# Altium project rasp_sheild.PrjPcb
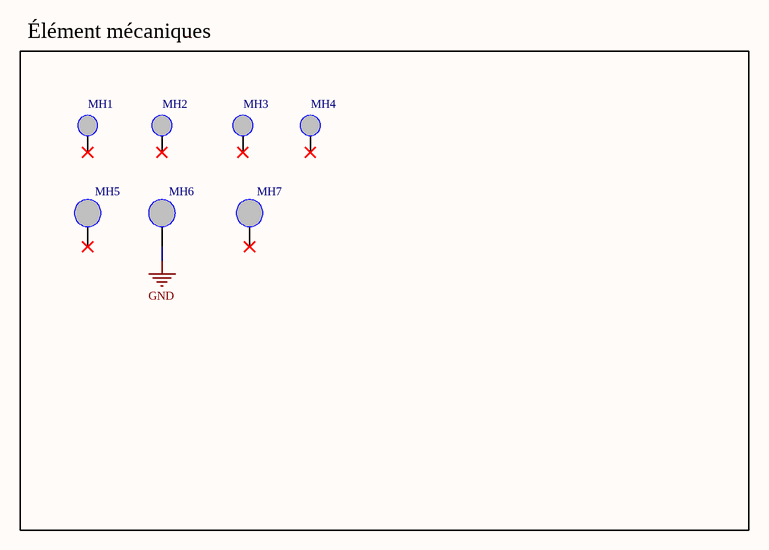
[diagram p0: rasp_sheild_title.SchDoc]
Project_Date: 2023-02-10; Project_Designer1: Julien Roy-Sabourin; Project_Global: Frigorus System; Project_Group: Frigorus; Project_Name: RaspberryPi Frigorus Sheild; Project_Revision: 1.0
5 sheets, 128 parts. Net scope: flat (ports and power ports of the same name join across sheets).
Board file: rasp_sheild.PcbDoc
Sheets:
  rasp_sheild_title.SchDoc
  rasp_sheild_main.SchDoc
  rasp_sheild_ADC.SchDoc
  rasp_sheild_i2c.SchDoc
  rasp_sheild_CAN.SchDoc

## Sheet rasp_sheild_title.SchDoc
size Tabloid; SheetNumber: 1; SheetTotal: 5; Sheet_Name: Insert name in Document Parameters; Size: 11x17

### Parts
MH1  Part Number  [MH2.75mm]  (value not drawn)
MH2  Part Number  [MH2.75mm]  (value not drawn)
MH3  Part Number  [MH2.75mm]  (value not drawn)
MH4  Part Number  [MH2.75mm]  (value not drawn)
MH5  Part Number  [MH3.2mm]  (value not drawn)
MH6  Part Number  [MH3.2mm]  (value not drawn)
MH7  Part Number  [MH3.2mm]  (value not drawn)

### Blocks framed on the sheet
Élément mécaniques: MH1-MH7

### Nets
GND: MH6.1

Not connected (* = marked no-connect by the designer): MH1 1*; MH2 1*; MH3 1*; MH4 1*; MH5 1*; MH7 1*

### Notes on the sheet
- Revision history
- Package size conversion
- Metric
- 1005
- 1608
- Imperial
- 0402
- 0603
- Revision
- 2012
- 3216
- 0805
- 1206
- 3225
- 6432
- 1210
- 2512
- Date :
- Project Title
- Global Project
- Size
- Group
- Date
- Sheet
- of
- Filename
- Designers

### Library data of the parts
MH1-MH4 = MH2.75mm: XXX - Description - Package; GRAMS Lib Spec: 2.7
MH5-MH7 = MH3.2mm: M3 mounting hole; GRAMS Lib Spec: 2.7

## Sheet rasp_sheild_main.SchDoc
size Tabloid; SheetNumber: 2; SheetTotal: 5; Sheet_Name: RaspberryPi Frigorus Sheild; Size: 11x17
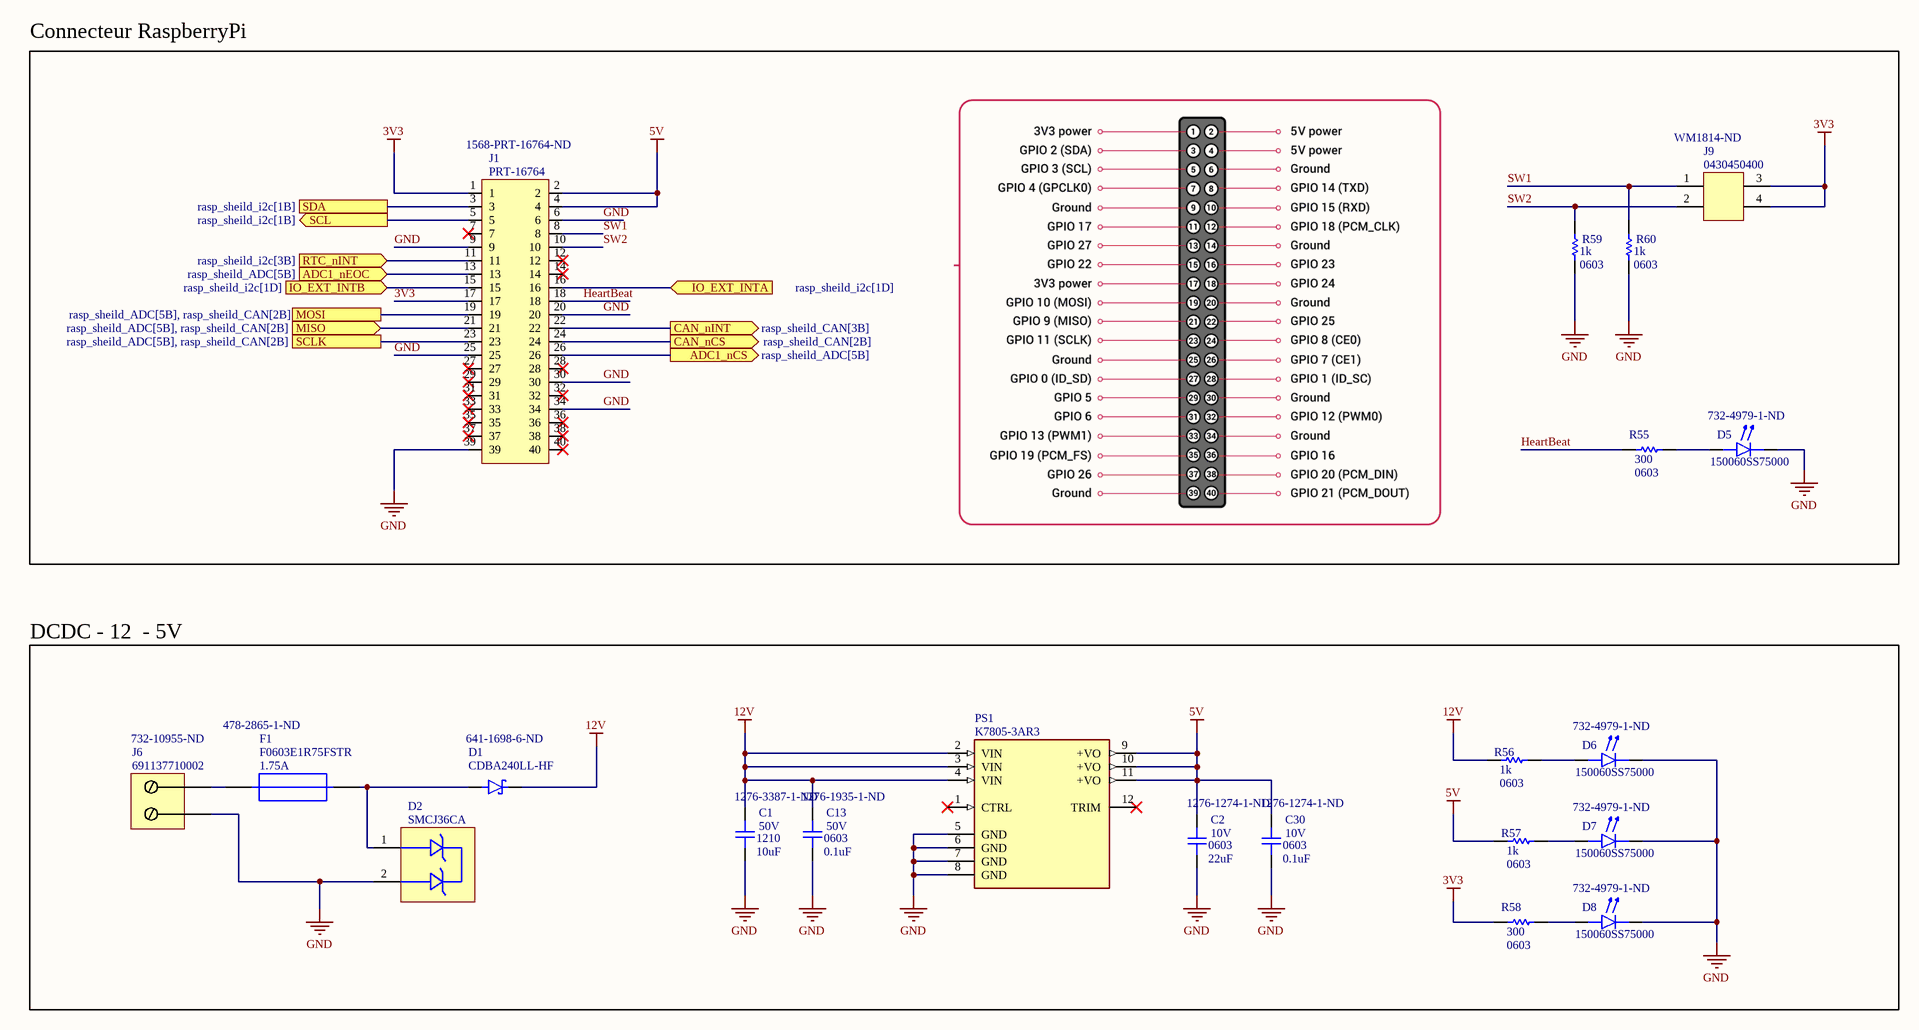
[diagram p1: rasp_sheild_main.SchDoc]

### Parts
C1  value 10uF  Voltage Rating: 50V  Package: 1210  Supplier Part Number 1: 1276-3387-1-ND  [CAP_1210]  (hidden comment: CL32B106KBJNNNE)
C2  value 22uF  Voltage Rating: 10V  Package: 0603  Supplier Part Number 1: 1276-1274-1-ND  [CAP_0603]  (hidden comment: CL10A226MP8NUNE)
C13  value 0.1uF  Voltage Rating: 50V  Package: 0603  Supplier Part Number 1: 1276-1935-1-ND  [CAP_0603]  (hidden comment: CL10B104KB8NNWC)
C30  value 0.1uF  Voltage Rating: 10V  Package: 0603  Supplier Part Number 1: 1276-1274-1-ND  [CAP_0603]  (hidden comment: CL10A226MP8NUNE)
D1  CDBA240LL-HF  Supplier Part Number 1: 641-1698-6-ND  [DO-214]
D2  SMCJ36CA  [SMCJ36CA]
D5  150060SS75000  Supplier Part Number 1: 732-4979-1-ND  [LED 0603]
D6  150060SS75000  Supplier Part Number 1: 732-4979-1-ND  [LED 0603]
D7  150060SS75000  Supplier Part Number 1: 732-4979-1-ND  [LED 0603]
D8  150060SS75000  Supplier Part Number 1: 732-4979-1-ND  [LED 0603]
F1  F0603E1R75FSTR  value 1.75A  Supplier Part Number 1: 478-2865-1-ND  [RES_0603]
J1  PRT-16764  Supplier Part Number 1: 1568-PRT-16764-ND  [PRT-16764]
J6  691137710002  Supplier Part Number 1: 732-10955-ND  [691137710002]
J9  0430450400  Supplier Part Number 1: WM1814-ND  [0430450400]
PS1  K7805-3AR3  [CONV_K7805-3AR3]
R55  value 300  Package: 0603  [RES_0603]  (hidden comment: RC0603JR-07300RL)
R56  value 1k  Package: 0603  [RES_0603]  (hidden comment: Part Number)
R57  value 1k  Package: 0603  [RES_0603]  (hidden comment: Part Number)
R58  value 300  Package: 0603  [RES_0603]  (hidden comment: RC0603JR-07300RL)
R59  value 1k  Package: 0603  [RES_0603]  (hidden comment: Part Number)
R60  value 1k  Package: 0603  [RES_0603]  (hidden comment: Part Number)

### Blocks framed on the sheet
Connecteur RaspberryPi: D5 J1 J9 R55 R59 R60
DCDC - 12  - 5V: C1 C2 C13 C30 D1 D2 D6-D8 F1 J6 PS1 R56-R58

### Ports
ADC1_nCS (out, see rasp_sheild_ADC[5B]), ADC1_nEOC (in, see rasp_sheild_ADC[5B]), CAN_nCS (out, see rasp_sheild_CAN[2B]), CAN_nINT (out, see rasp_sheild_CAN[3B]), IO_EXT_INTA (in, see rasp_sheild_i2c[1D]), IO_EXT_INTB (in, see rasp_sheild_i2c[1D]), MISO (in, see rasp_sheild_ADC[5B], rasp_sheild_CAN[2B]), MOSI (see rasp_sheild_ADC[5B], rasp_sheild_CAN[2B]), RTC_nINT (in, see rasp_sheild_i2c[3B]), SCL (out, see rasp_sheild_i2c[1B]), SCLK (see rasp_sheild_ADC[5B], rasp_sheild_CAN[2B]), SDA (see rasp_sheild_i2c[1B])

### Nets
3V3: J1.1 J1.17 J9.3 J9.4 R58.2
5V: C2.2 C30.2 J1.2 J1.4 PS1.9(+VO) PS1.10(+VO) PS1.11(+VO) R57.2
12V: C1.2 C13.2 D1.C(K) PS1.2(VIN) PS1.3(VIN) PS1.4(VIN) R56.2
GND: C1.1 C2.1 C13.1 C30.1 D2.2 D5.K D6.K D7.K D8.K J1.6 J1.9 J1.20 J1.25 J1.30 J1.34 J1.39 J6.2 PS1.5(GND) PS1.6(GND) PS1.7(GND) PS1.8(GND) R59.1 R60.1
ADC1_nCS: J1.26 ; port ADC1_nCS
ADC1_nEOC: J1.13 ; port ADC1_nEOC
CAN_nCS: J1.24 ; port CAN_nCS
CAN_nINT: J1.22 ; port CAN_nINT
HeartBeat: J1.18 R55.2
IO_EXT_INTA: J1.16 ; port IO_EXT_INTA
IO_EXT_INTB: J1.15 ; port IO_EXT_INTB
MISO: J1.21 ; port MISO
MOSI: J1.19 ; port MOSI
RTC_nINT: J1.11 ; port RTC_nINT
SCL: J1.5 ; port SCL
SCLK: J1.23 ; port SCLK
SDA: J1.3 ; port SDA
SW1: J1.8 J9.1 R60.2
SW2: J1.10 J9.2 R59.2
NetD1_A: D1.A D2.1 F1.2
NetD5_A: D5.A R55.1
NetD6_A: D6.A R56.1
NetD7_A: D7.A R57.1
NetD8_A: D8.A R58.1
NetF1_1: F1.1 J6.1

Not connected (* = marked no-connect by the designer): J1 7* 12* 14* 27* 28* 29* 31* 32* 33* 35* 36* 37* 38* 40*; PS1 1(CTRL)* 12(TRIM)*

### Notes on the sheet
- Sheet Name
- Project Title
- Global Project
- Revision
- Size
- Date
- Group
- Sheet
- of
- Filename
- Designers

### Library data of the parts
C1 = CAP_1210: XXX - Description - Package; GRAMS Lib Spec: 2.7; Supplier 1: Digi-Key
C2 C13 C30 = CAP_0603: XXX - Description - Package; GRAMS Lib Spec: 2.7; Supplier 1: Digi-Key
D1 = CDBA240LL-HF: Diode 40 V 2A Surface Mount DO-214AC (SMA); GRAMS Lib Spec: 2.7; Supplier 1: Digi-Key
D2 = SMCJ36CA: 44.2V Clamp 25.8A Ipp Tvs Diode Surface Mount DO-214AB (SMC); GRAMS Lib Spec: 2.7
D5-D8 = 150060SS75000: Red 630nm LED Indication - Discrete 1.9V 0603 (1608 Metric); GRAMS Lib Spec: 2.7; Supplier 1: Digi-Key
F1 = F0603E1R75FSTR: 1.75 A AC 32 V DC Fuse Board Mount (Cartridge Style Excluded) Surface Mount 0603 (1608 Metric); GRAMS Lib Spec: 2.7; Supplier 1: Digi-Key
J1 = PRT-14275_1: EXTENDED GPIO FEMALE HEADER - 2X; GRAMS Lib Spec: 2.7; Supplier 1: Digi-Key
J6 = 691137710002: 2 Position Wire to Board Terminal Block Horizontal with Board 0.197" (5.00mm) Through Hole; GRAMS Lib Spec: 2.7; Supplier 1: Digi-Key
J9 = 0430450400: Connector Header Through Hole, Right Angle 4 position 0.118" (3.00mm); GRAMS Lib Spec: 2.7; Supplier 1: Digi-Key
PS1 = K7805-3AR3: Non-Isolated PoL Module DC DC Converter 1 Output 5V - - - 3A 8V - 36V Input; MF: Mornsun America, LLC; Value: *; SnapEDA_Link: https://www.snapeda.com/parts/K7805-3AR3/MORNSUN/view-part/?ref=snap; Purchase-URL: https://pricing.snapeda.com/search/part/K7805-3AR3/?ref=eda; Availability: In Stock; Price: None; Package: SIP-12-12 MORNSUN; Check_prices: https://www.snapeda.com/parts/K7805-3AR3/MORNSUN/view-part/?ref=eda; MP: K7805-3AR3; Supplier 1: Digi-Key; Supplier Part Number 1: 2725-K7805-3AR3-ND
R55-R60 = RES_0603: XXX - Description - Package; GRAMS Lib Spec: 2.7; Supplier 1: Digi-Key
  R55 R58: Supplier Part Number 1: 311-300GRCT-ND
  R56 R57 R59 R60: Supplier Part Number 1: 311-1.00KHRCT-ND

## Sheet rasp_sheild_ADC.SchDoc
size Tabloid; SheetNumber: 3; SheetTotal: 5; Sheet_Name: Lecture analogique thermistances; Size: 11x17
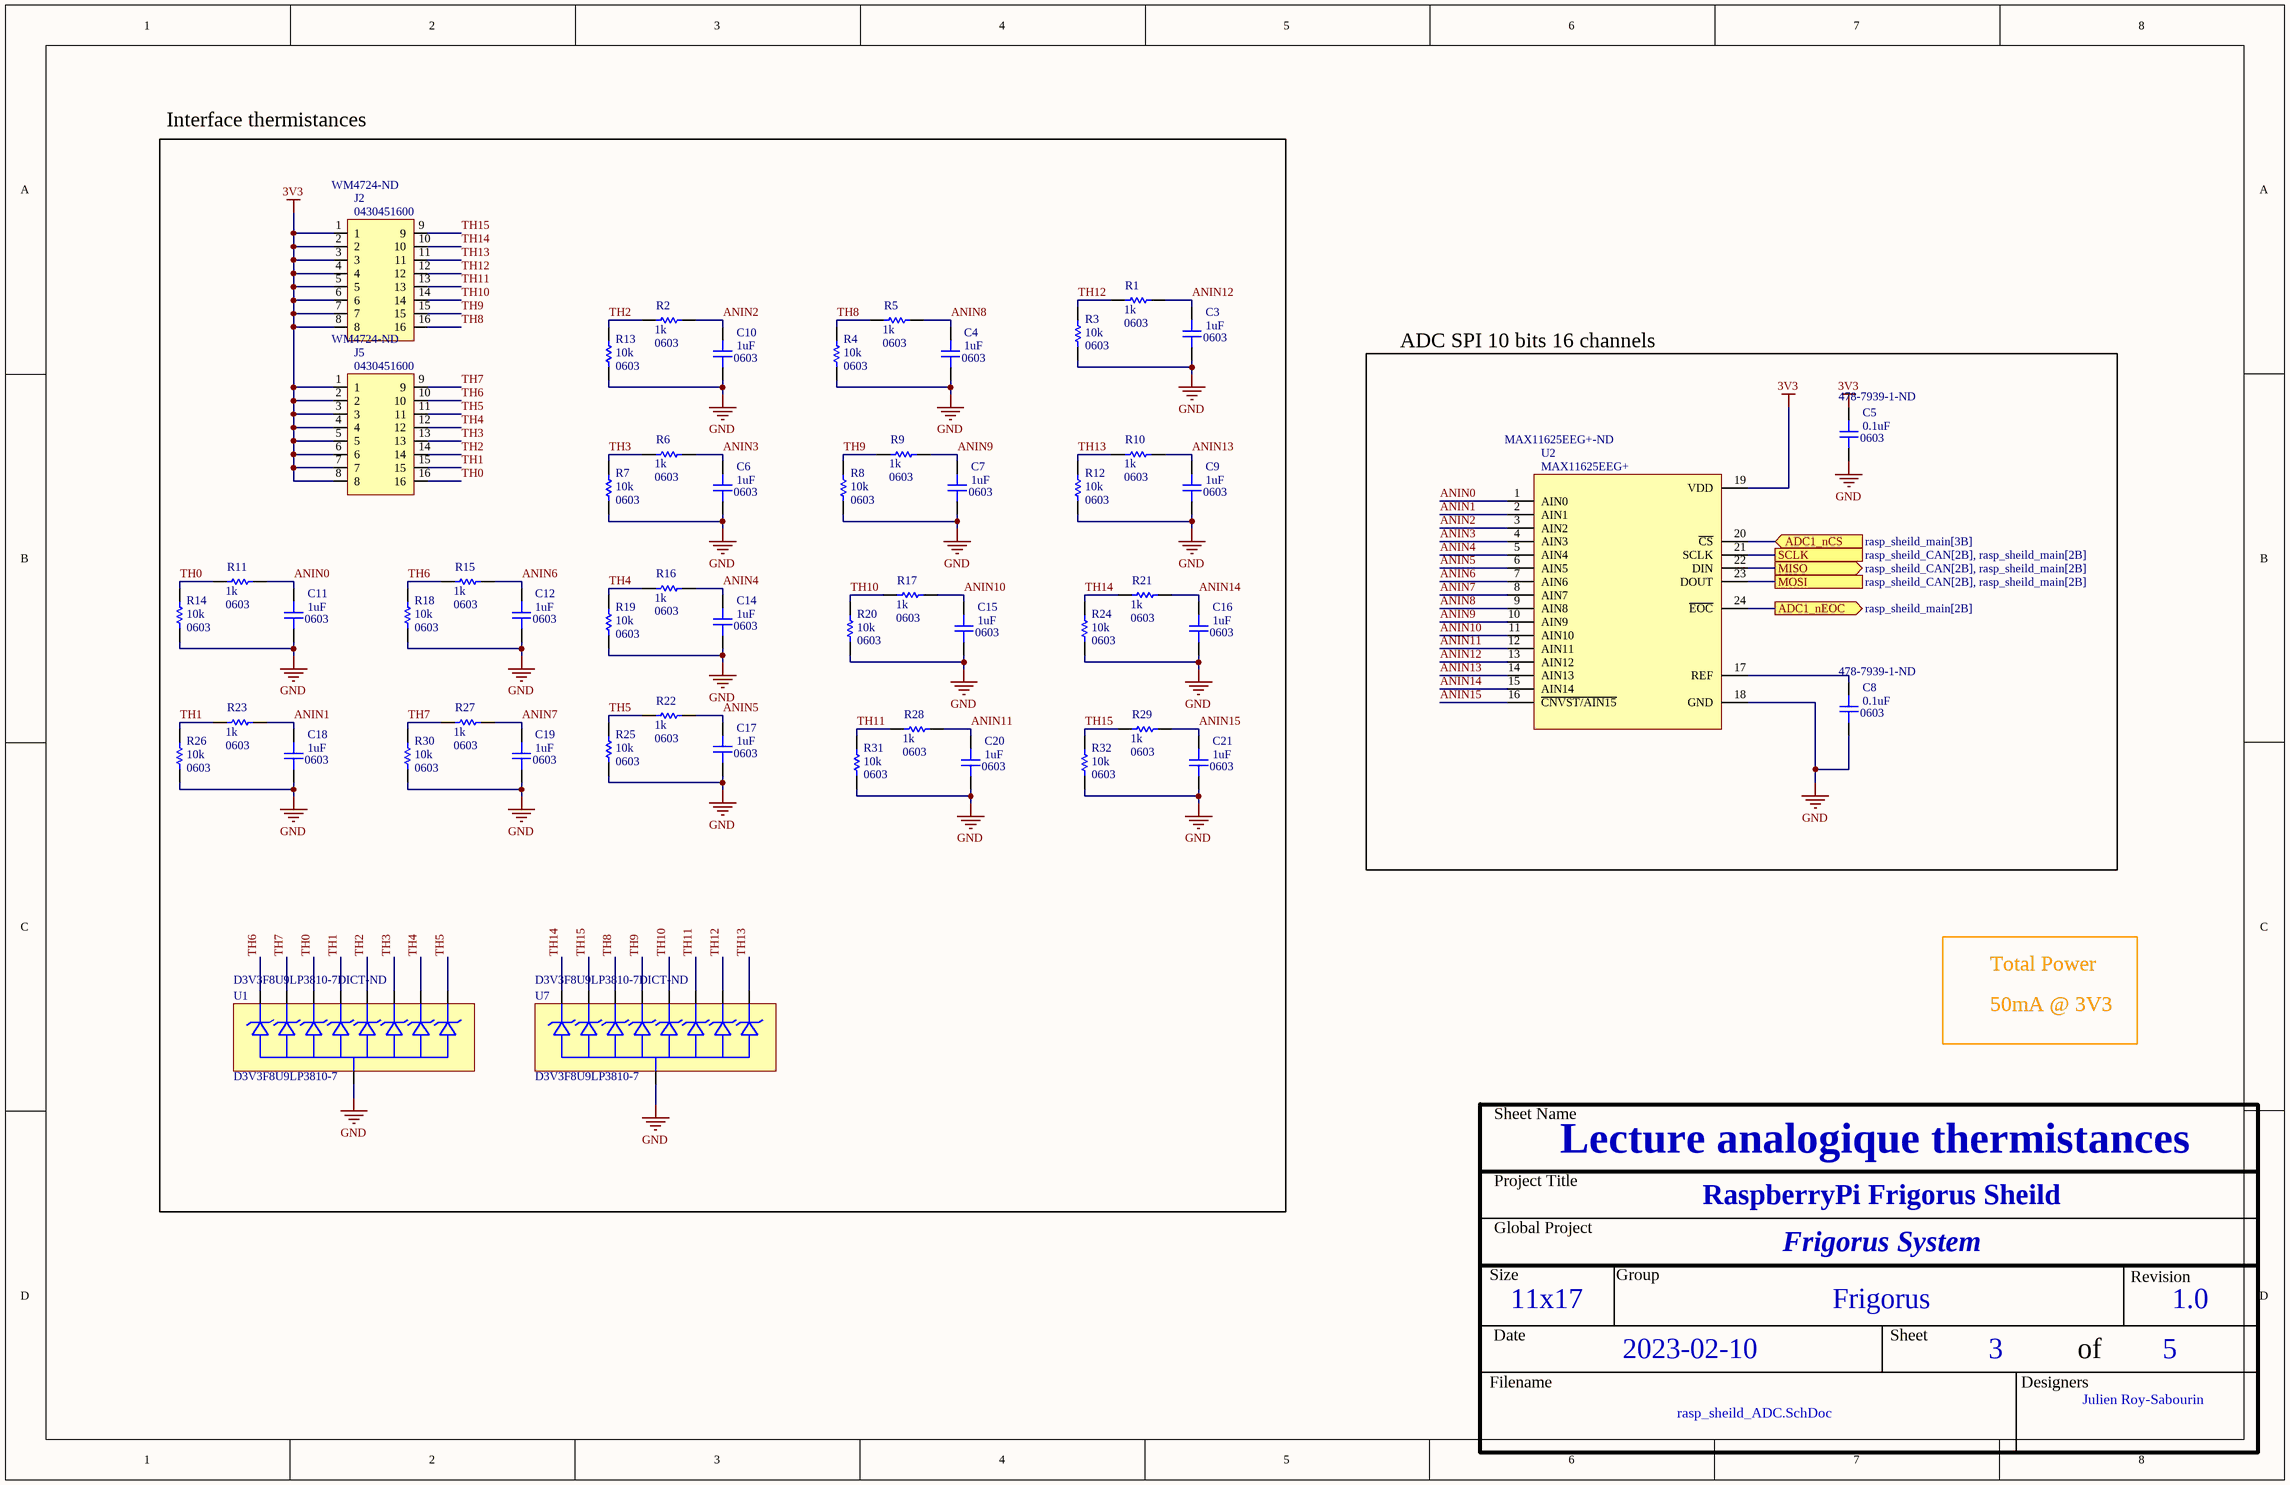
[diagram p2: rasp_sheild_ADC.SchDoc]

### Parts
C3  value 1uF  Package: 0603  [CAP_0603]  (hidden comment: Part Number)
C4  value 1uF  Package: 0603  [CAP_0603]  (hidden comment: Part Number)
C5  value 0.1uF  Package: 0603  Supplier Part Number 1: 478-7939-1-ND  [CAP_0603]  (hidden comment: Part Number)
C6  value 1uF  Package: 0603  [CAP_0603]  (hidden comment: Part Number)
C7  value 1uF  Package: 0603  [CAP_0603]  (hidden comment: Part Number)
C8  value 0.1uF  Package: 0603  Supplier Part Number 1: 478-7939-1-ND  [CAP_0603]  (hidden comment: Part Number)
C9  value 1uF  Package: 0603  [CAP_0603]  (hidden comment: Part Number)
C10  value 1uF  Package: 0603  [CAP_0603]  (hidden comment: Part Number)
C11  value 1uF  Package: 0603  [CAP_0603]  (hidden comment: Part Number)
C12  value 1uF  Package: 0603  [CAP_0603]  (hidden comment: Part Number)
C14  value 1uF  Package: 0603  [CAP_0603]  (hidden comment: Part Number)
C15  value 1uF  Package: 0603  [CAP_0603]  (hidden comment: Part Number)
C16  value 1uF  Package: 0603  [CAP_0603]  (hidden comment: Part Number)
C17  value 1uF  Package: 0603  [CAP_0603]  (hidden comment: Part Number)
C18  value 1uF  Package: 0603  [CAP_0603]  (hidden comment: Part Number)
C19  value 1uF  Package: 0603  [CAP_0603]  (hidden comment: Part Number)
C20  value 1uF  Package: 0603  [CAP_0603]  (hidden comment: Part Number)
C21  value 1uF  Package: 0603  [CAP_0603]  (hidden comment: Part Number)
J2  0430451600  Supplier Part Number 1: WM4724-ND  [0430451600]
J5  0430451600  Supplier Part Number 1: WM4724-ND  [0430451600]
R1  value 1k  Package: 0603  [RES_0603]  (hidden comment: Part Number)
R2  value 1k  Package: 0603  [RES_0603]  (hidden comment: Part Number)
R3  value 10k  Package: 0603  [RES_0603]  (hidden comment: Part Number)
R4  value 10k  Package: 0603  [RES_0603]  (hidden comment: Part Number)
R5  value 1k  Package: 0603  [RES_0603]  (hidden comment: Part Number)
R6  value 1k  Package: 0603  [RES_0603]  (hidden comment: Part Number)
R7  value 10k  Package: 0603  [RES_0603]  (hidden comment: Part Number)
R8  value 10k  Package: 0603  [RES_0603]  (hidden comment: Part Number)
R9  value 1k  Package: 0603  [RES_0603]  (hidden comment: Part Number)
R10  value 1k  Package: 0603  [RES_0603]  (hidden comment: Part Number)
R11  value 1k  Package: 0603  [RES_0603]  (hidden comment: Part Number)
R12  value 10k  Package: 0603  [RES_0603]  (hidden comment: Part Number)
R13  value 10k  Package: 0603  [RES_0603]  (hidden comment: Part Number)
R14  value 10k  Package: 0603  [RES_0603]  (hidden comment: Part Number)
R15  value 1k  Package: 0603  [RES_0603]  (hidden comment: Part Number)
R16  value 1k  Package: 0603  [RES_0603]  (hidden comment: Part Number)
R17  value 1k  Package: 0603  [RES_0603]  (hidden comment: Part Number)
R18  value 10k  Package: 0603  [RES_0603]  (hidden comment: Part Number)
R19  value 10k  Package: 0603  [RES_0603]  (hidden comment: Part Number)
R20  value 10k  Package: 0603  [RES_0603]  (hidden comment: Part Number)
R21  value 1k  Package: 0603  [RES_0603]  (hidden comment: Part Number)
R22  value 1k  Package: 0603  [RES_0603]  (hidden comment: Part Number)
R23  value 1k  Package: 0603  [RES_0603]  (hidden comment: Part Number)
R24  value 10k  Package: 0603  [RES_0603]  (hidden comment: Part Number)
R25  value 10k  Package: 0603  [RES_0603]  (hidden comment: Part Number)
R26  value 10k  Package: 0603  [RES_0603]  (hidden comment: Part Number)
R27  value 1k  Package: 0603  [RES_0603]  (hidden comment: Part Number)
R28  value 1k  Package: 0603  [RES_0603]  (hidden comment: Part Number)
R29  value 1k  Package: 0603  [RES_0603]  (hidden comment: Part Number)
R30  value 10k  Package: 0603  [RES_0603]  (hidden comment: Part Number)
R31  value 10k  Package: 0603  [RES_0603]  (hidden comment: Part Number)
R32  value 10k  Package: 0603  [RES_0603]  (hidden comment: Part Number)
U1  D3V3F8U9LP3810-7  Supplier Part Number 1: D3V3F8U9LP3810-7DICT-ND  [D3V3F8U9LP3810-7]
U2  MAX11625EEG+  Supplier Part Number 1: MAX11625EEG+-ND  [24-QSSOP]
U7  D3V3F8U9LP3810-7  Supplier Part Number 1: D3V3F8U9LP3810-7DICT-ND  [D3V3F8U9LP3810-7]

### Blocks framed on the sheet
Interface thermistances: C3 C4 C6 C7 C9-C12 C14-C21 J2 J5 R1-R32 U1 U7
ADC SPI 10 bits 16 channels: C5 C8 U2

### Ports
ADC1_nCS (in, see rasp_sheild_main[3B]), ADC1_nEOC (out, see rasp_sheild_main[2B]), MISO (out, see rasp_sheild_CAN[2B], rasp_sheild_main[2B]), MOSI (see rasp_sheild_CAN[2B], rasp_sheild_main[2B]), SCLK (see rasp_sheild_CAN[2B], rasp_sheild_main[2B])

### Nets
3V3: C5.2 J2.1 J2.2 J2.3 J2.4 J2.5 J2.6 J2.7 J2.8 J5.1 J5.2 J5.3 J5.4 J5.5 J5.6 J5.7 J5.8 U2.19(VDD)
GND: C3.1 C4.1 C5.1 C6.1 C7.1 C8.1 C9.1 C10.1 C11.1 C12.1 C14.1 C15.1 C16.1 C17.1 C18.1 C19.1 C20.1 C21.1 R3.2 R4.2 R7.2 R8.2 R12.2 R13.2 R14.2 R18.2 R19.2 R20.2 R24.2 R25.2 R26.2 R30.2 R31.2 R32.2 U1.3 U2.18(GND) U7.3
ADC1_nCS: U2.20(~{CS}) ; port ADC1_nCS
ADC1_nEOC: U2.24(~{EOC}) ; port ADC1_nEOC
ANIN0: C11.2 R11.1 U2.1(AIN0)
ANIN1: C18.2 R23.1 U2.2(AIN1)
ANIN2: C10.2 R2.1 U2.3(AIN2)
ANIN3: C6.2 R6.1 U2.4(AIN3)
ANIN4: C14.2 R16.1 U2.5(AIN4)
ANIN5: C17.2 R22.1 U2.6(AIN5)
ANIN6: C12.2 R15.1 U2.7(AIN6)
ANIN7: C19.2 R27.1 U2.8(AIN7)
ANIN8: C4.2 R5.1 U2.9(AIN8)
ANIN9: C7.2 R9.1 U2.10(AIN9)
ANIN10: C15.2 R17.1 U2.11(AIN10)
ANIN11: C20.2 R28.1 U2.12(AIN11)
ANIN12: C3.2 R1.1 U2.13(AIN12)
ANIN13: C9.2 R10.1 U2.14(AIN13)
ANIN14: C16.2 R21.1 U2.15(AIN14)
ANIN15: C21.2 R29.1 U2.16(~{CNVST/AIN15})
MISO: U2.22(DIN) ; port MISO
MOSI: U2.23(DOUT) ; port MOSI
SCLK: U2.21(SCLK) ; port SCLK
TH0: J5.16 R11.2 R14.1 U1.4
TH1: J5.15 R23.2 R26.1 U1.5
TH2: J5.14 R2.2 R13.1 U1.6
TH3: J5.13 R6.2 R7.1 U1.7
TH4: J5.12 R16.2 R19.1 U1.8
TH5: J5.11 R22.2 R25.1 U1.9
TH6: J5.10 R15.2 R18.1 U1.1
TH7: J5.9 R27.2 R30.1 U1.2
TH8: J2.16 R4.1 R5.2 U7.4
TH9: J2.15 R8.1 R9.2 U7.5
TH10: J2.14 R17.2 R20.1 U7.6
TH11: J2.13 R28.2 R31.1 U7.7
TH12: J2.12 R1.2 R3.1 U7.8
TH13: J2.11 R10.2 R12.1 U7.9
TH14: J2.10 R21.2 R24.1 U7.1
TH15: J2.9 R29.2 R32.1 U7.2
NetC8_2: C8.2 U2.17(REF)

### Notes on the sheet
- Total Power
- 50mA @ 3V3
- Sheet Name
- Project Title
- Global Project
- Size
- Group
- Revision
- Date
- Sheet
- of
- Filename
- Designers

### Library data of the parts
C3-C12 C14-C21 = CAP_0603: as C2 on sheet rasp_sheild_main; Supplier 1: Digi-Key
  C3 C4 C6 C7 C9-C12 C14-C21: Supplier Part Number 1: 399-C0603C105K8RAC7867CT-ND
J2 J5 = 0430451600: Connector Header Through Hole, Right Angle 16 position 0.118" (3.00mm); GRAMS Lib Spec: 2.7; Supplier 1: Digi-Key
R1-R32 = RES_0603: as R55 on sheet rasp_sheild_main; Supplier 1: Digi-Key
  R1 R2 R5 R6 R9-R11 R15-R17 R21-R23 R27-R29: Supplier Part Number 1: 311-1.00KHRCT-ND
  R3 R4 R7 R8 R12-R14 R18-R20 R24-R26 R30-R32: Supplier Part Number 1: 311-10.0KHRCT-ND
U1 U7 = D3V3F8U9LP3810-7: 5V (Typ) Clamp 5A (8/20µs) Ipp Tvs Diode Surface Mount U-DFN3810-9 (Type B); GRAMS Lib Spec: 2.7; Supplier 1: Digi-Key
U2 = MAX11625EEG+: 10 Bit Analog to Digital Converter 16 Input 1 SAR 24-QSOP; GRAMS Lib Spec: 2.7; Supplier 1: Digi-Key

## Sheet rasp_sheild_i2c.SchDoc
size Tabloid; SheetNumber: 4; SheetTotal: 5; Sheet_Name: Périphériques i2c; Size: 11x17
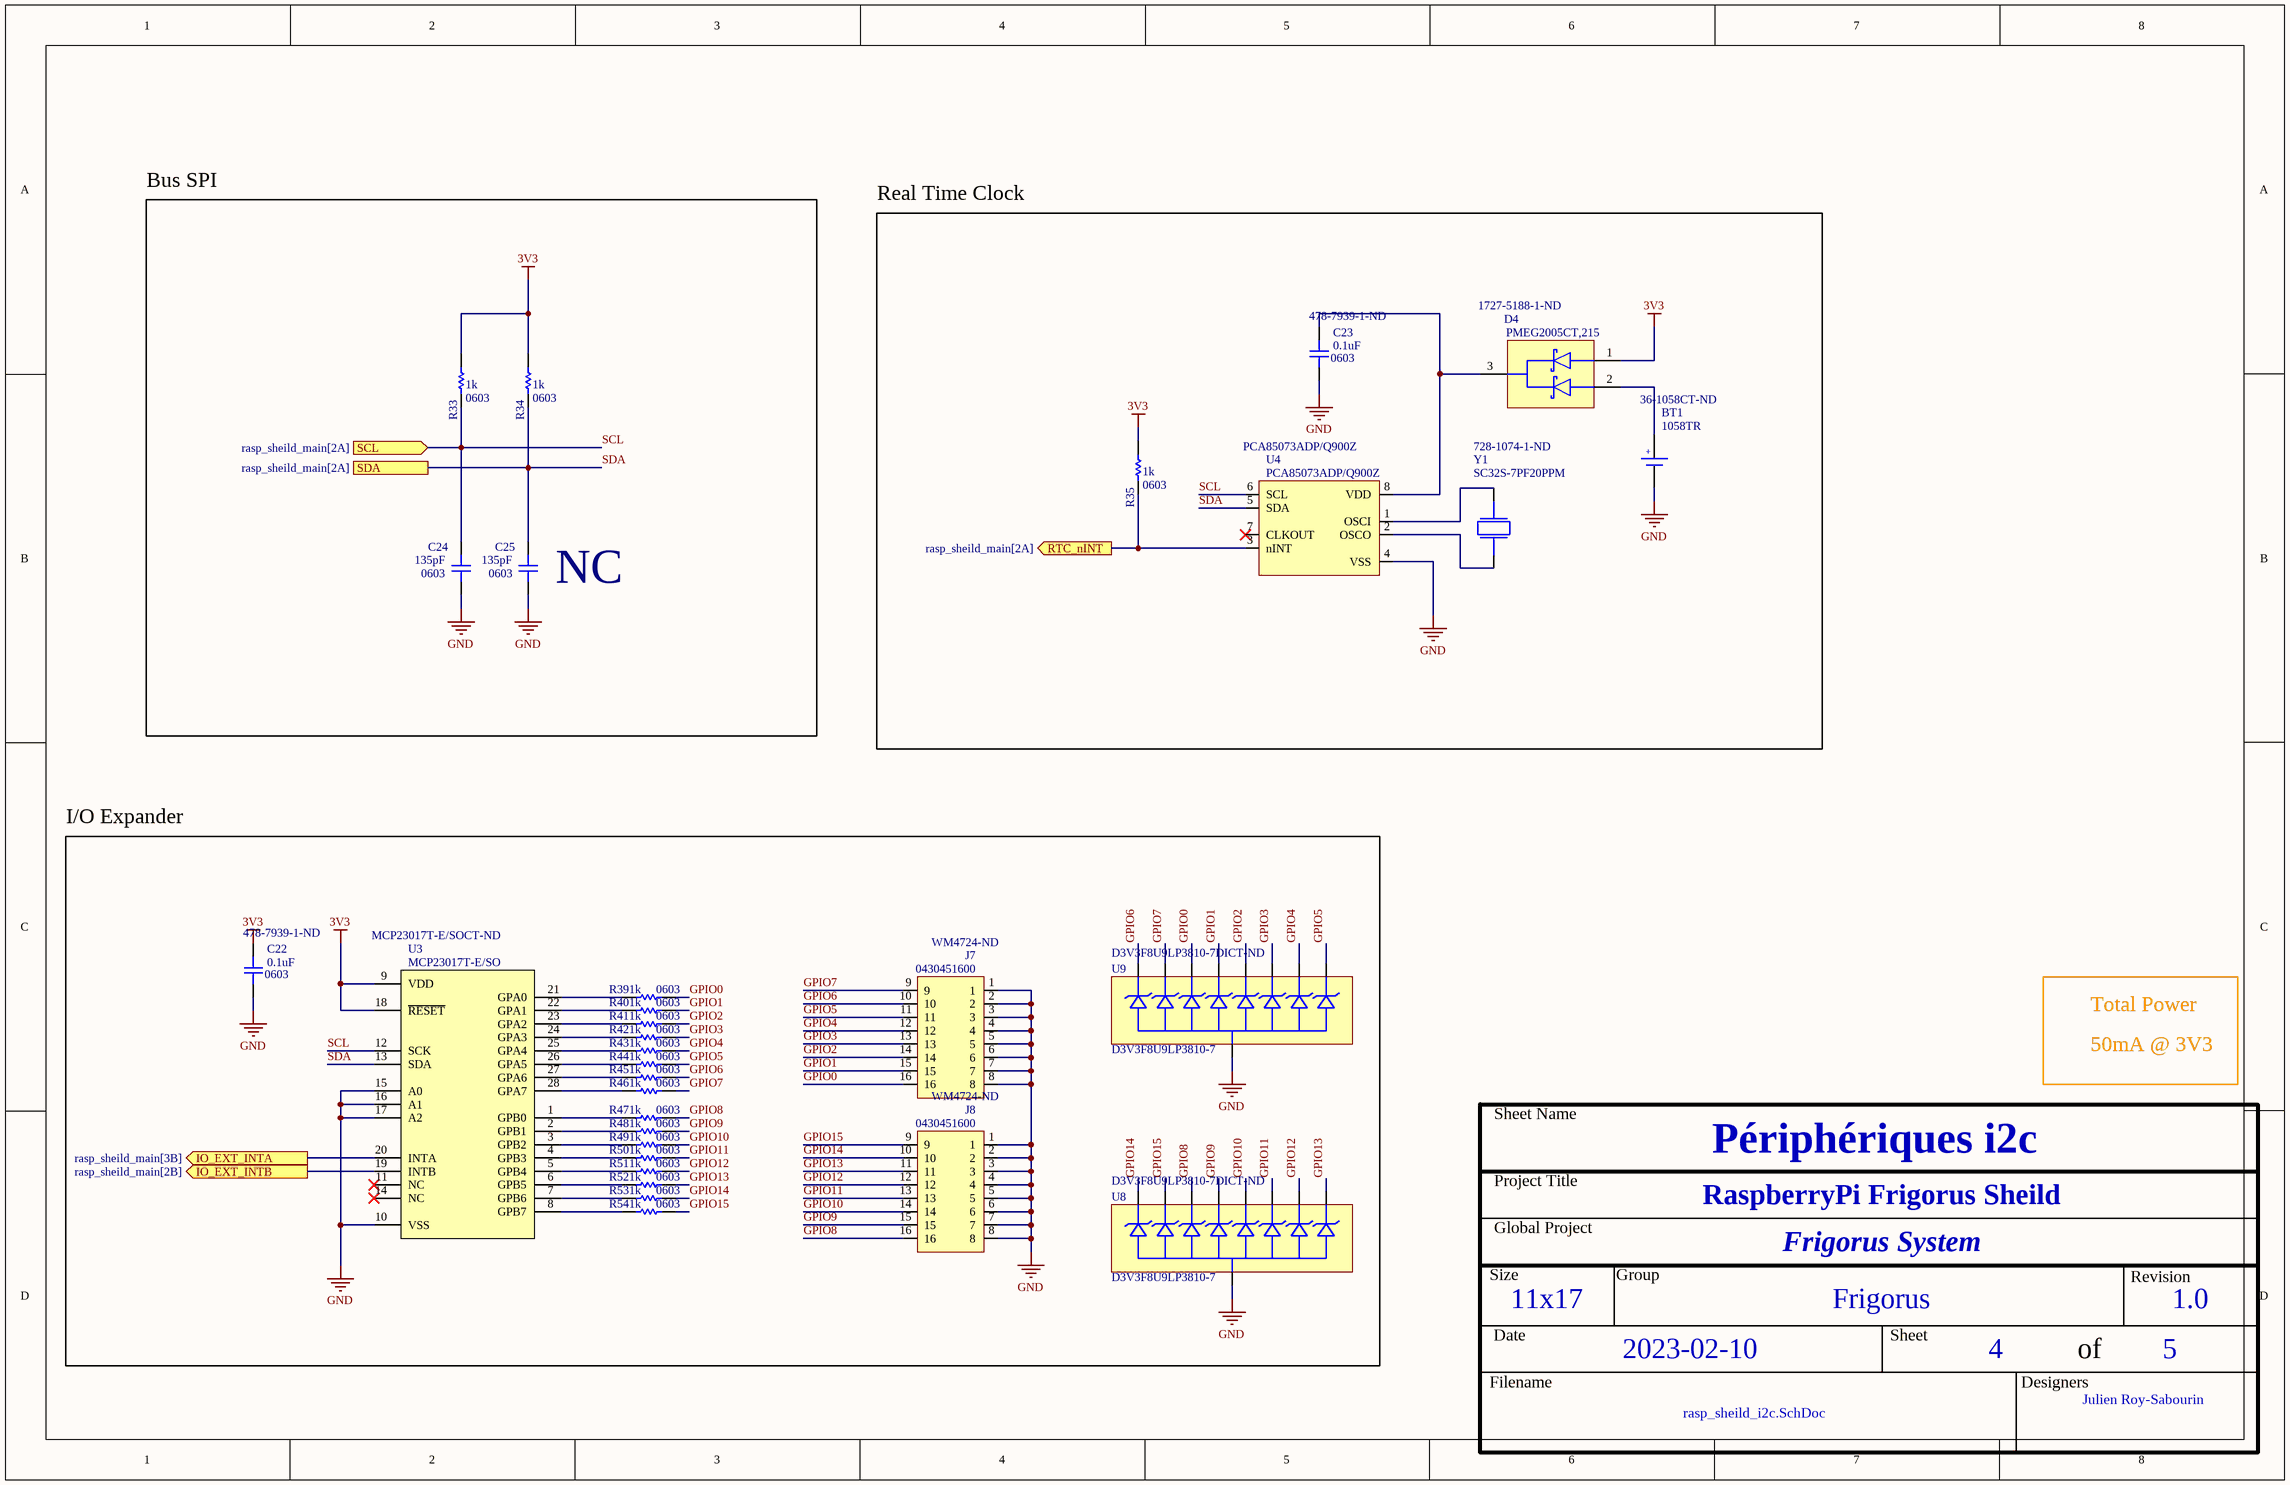
[diagram p3: rasp_sheild_i2c.SchDoc]

### Parts
BT1  1058TR  Supplier Part Number 1: 36-1058CT-ND  [1058TR]
C22  value 0.1uF  Package: 0603  Supplier Part Number 1: 478-7939-1-ND  [CAP_0603]  (hidden comment: Part Number)
C23  value 0.1uF  Package: 0603  Supplier Part Number 1: 478-7939-1-ND  [CAP_0603]  (hidden comment: Part Number)
C24  value 135pF  Package: 0603  [CAP_0603]  (hidden comment: Part Number)
C25  value 135pF  Package: 0603  [CAP_0603]  (hidden comment: Part Number)
D4  PMEG2005CT,215  Supplier Part Number 1: 1727-5188-1-ND  [SOT-23-3]
J7  0430451600  Supplier Part Number 1: WM4724-ND  [0430451600]
J8  0430451600  Supplier Part Number 1: WM4724-ND  [0430451600]
R33  value 1k  Package: 0603  [RES_0603]  (hidden comment: Part Number)
R34  value 1k  Package: 0603  [RES_0603]  (hidden comment: Part Number)
R35  value 1k  Package: 0603  [RES_0603]  (hidden comment: Part Number)
R39  value 1k  Package: 0603  [RES_0603]  (hidden comment: Part Number)
R40  value 1k  Package: 0603  [RES_0603]  (hidden comment: Part Number)
R41  value 1k  Package: 0603  [RES_0603]  (hidden comment: Part Number)
R42  value 1k  Package: 0603  [RES_0603]  (hidden comment: Part Number)
R43  value 1k  Package: 0603  [RES_0603]  (hidden comment: Part Number)
R44  value 1k  Package: 0603  [RES_0603]  (hidden comment: Part Number)
R45  value 1k  Package: 0603  [RES_0603]  (hidden comment: Part Number)
R46  value 1k  Package: 0603  [RES_0603]  (hidden comment: Part Number)
R47  value 1k  Package: 0603  [RES_0603]  (hidden comment: Part Number)
R48  value 1k  Package: 0603  [RES_0603]  (hidden comment: Part Number)
R49  value 1k  Package: 0603  [RES_0603]  (hidden comment: Part Number)
R50  value 1k  Package: 0603  [RES_0603]  (hidden comment: Part Number)
R51  value 1k  Package: 0603  [RES_0603]  (hidden comment: Part Number)
R52  value 1k  Package: 0603  [RES_0603]  (hidden comment: Part Number)
R53  value 1k  Package: 0603  [RES_0603]  (hidden comment: Part Number)
R54  value 1k  Package: 0603  [RES_0603]  (hidden comment: Part Number)
U3  MCP23017T-E/SO  Supplier Part Number 1: MCP23017T-E/SOCT-ND  [28-SOIC]
U4  PCA85073ADP/Q900Z  [8-MSOP]
U8  D3V3F8U9LP3810-7  Supplier Part Number 1: D3V3F8U9LP3810-7DICT-ND  [D3V3F8U9LP3810-7]
U9  D3V3F8U9LP3810-7  Supplier Part Number 1: D3V3F8U9LP3810-7DICT-ND  [D3V3F8U9LP3810-7]
Y1  SC32S-7PF20PPM  Supplier Part Number 1: 728-1074-1-ND  [SC32S-7PF20PPM]

### Blocks framed on the sheet
NC: C24 C25 R33 R34
Real Time Clock: BT1 C23 D4 R35 U4 Y1
I/O Expander: C22 J7 J8 R39-R54 U3 U8 U9

### Ports
IO_EXT_INTA (out, see rasp_sheild_main[3B]), IO_EXT_INTB (out, see rasp_sheild_main[2B]), RTC_nINT (out, see rasp_sheild_main[2A]), SCL (in, see rasp_sheild_main[2A]), SDA (see rasp_sheild_main[2A])

### Nets
3V3: C22.2 D4.1 R33.1 R34.1 R35.1 U3.9(VDD) U3.18(~{RESET})
GND: BT1.2(-) C22.1 C23.1 C24.1 C25.1 J7.1 J7.2 J7.3 J7.4 J7.5 J7.6 J7.7 J7.8 J8.1 J8.2 J8.3 J8.4 J8.5 J8.6 J8.7 J8.8 U3.10(VSS) U3.15(A0) U3.16(A1) U3.17(A2) U4.4(VSS) U8.3 U9.3
GPIO0: J7.16 R39.1 U9.4
GPIO1: J7.15 R40.1 U9.5
GPIO2: J7.14 R41.1 U9.6
GPIO3: J7.13 R42.1 U9.7
GPIO4: J7.12 R43.1 U9.8
GPIO5: J7.11 R44.1 U9.9
GPIO6: J7.10 R45.1 U9.1
GPIO7: J7.9 R46.1 U9.2
GPIO8: J8.16 R47.1 U8.4
GPIO9: J8.15 R48.1 U8.5
GPIO10: J8.14 R49.1 U8.6
GPIO11: J8.13 R50.1 U8.7
GPIO12: J8.12 R51.1 U8.8
GPIO13: J8.11 R52.1 U8.9
GPIO14: J8.10 R53.1 U8.1
GPIO15: J8.9 R54.1 U8.2
IO_EXT_INTA: U3.20(INTA) ; port IO_EXT_INTA
IO_EXT_INTB: U3.19(INTB) ; port IO_EXT_INTB
RTC_nINT: R35.2 U4.3(nINT) ; port RTC_nINT
SCL: C24.2 R33.2 U3.12(SCK) U4.6(SCL) ; port SCL
SDA: C25.2 R34.2 U3.13(SDA) U4.5(SDA) ; port SDA
NetBT1_1: BT1.1(+) D4.2
NetC23_2: C23.2 D4.3 U4.8(VDD)
NetR39_2: R39.2 U3.21(GPA0)
NetR40_2: R40.2 U3.22(GPA1)
NetR41_2: R41.2 U3.23(GPA2)
NetR42_2: R42.2 U3.24(GPA3)
NetR43_2: R43.2 U3.25(GPA4)
NetR44_2: R44.2 U3.26(GPA5)
NetR45_2: R45.2 U3.27(GPA6)
NetR46_2: R46.2 U3.28(GPA7)
NetR47_2: R47.2 U3.1(GPB0)
NetR48_2: R48.2 U3.2(GPB1)
NetR49_2: R49.2 U3.3(GPB2)
NetR50_2: R50.2 U3.4(GPB3)
NetR51_2: R51.2 U3.5(GPB4)
NetR52_2: R52.2 U3.6(GPB5)
NetR53_2: R53.2 U3.7(GPB6)
NetR54_2: R54.2 U3.8(GPB7)
NetU4_1: U4.1(OSCI) Y1.2
NetU4_2: U4.2(OSCO) Y1.1

Not connected (* = marked no-connect by the designer): U3 11(NC)* 14(NC)*; U4 7(CLKOUT)*

### Notes on the sheet
- Bus SPI
- Total Power
- 50mA @ 3V3
- Sheet Name
- Project Title
- Global Project
- Size
- Group
- Revision
- Date
- Sheet
- of
- Filename
- Designers

### Library data of the parts
BT1 = 1058TR: Battery Holder (Open) Coin, 20.0mm 1 Cell SMD (SMT) Tab; GRAMS Lib Spec: 2.7; Supplier 1: Digi-Key
C22-C25 = CAP_0603: as C2 on sheet rasp_sheild_main
  C22 C23: Supplier 1: Digi-Key
D4 = PMEG2005CT,215: Diode Array 1 Pair Common Cathode 20 V 500mA Surface Mount TO-236-3, SC-59, SOT-23-3; GRAMS Lib Spec: 2.7; Supplier 1: Digi-Key
J7 J8 = 0430451600: as J2 on sheet rasp_sheild_ADC; Supplier 1: Digi-Key
R33-R35 R39-R54 = RES_0603: as R55 on sheet rasp_sheild_main; Supplier 1: Digi-Key; Supplier Part Number 1: 311-1.00KHRCT-ND
U3 = MCP23017T-E/SO: I/O Expander 16 I²C 1.7 MHz 28-SOIC; GRAMS Lib Spec: 2.7; Supplier 1: Digi-Key
U4 = PCA85073ADP/Q900Z: Real Time Clock (RTC) IC Clock/Calendar I²C 8-TSSOP, 8-MSOP (0.118", 3.00mm Width); GRAMS Lib Spec: 2.7; Supplier 1: Arrow Electronics; Supplier Part Number 1: PCA85073ADP/Q900Z
U8 U9 = D3V3F8U9LP3810-7: as U1 on sheet rasp_sheild_ADC; Supplier 1: Digi-Key
Y1 = SC32S-7PF20PPM: 32.768 kHz ±20ppm Crystal 7pF 70 kOhms 2-SMD, No Lead; GRAMS Lib Spec: 2.7; Supplier 1: Digi-Key

## Sheet rasp_sheild_CAN.SchDoc
size Tabloid; SheetNumber: 5; SheetTotal: 5; Sheet_Name: Comminication CAN; Size: 11x17
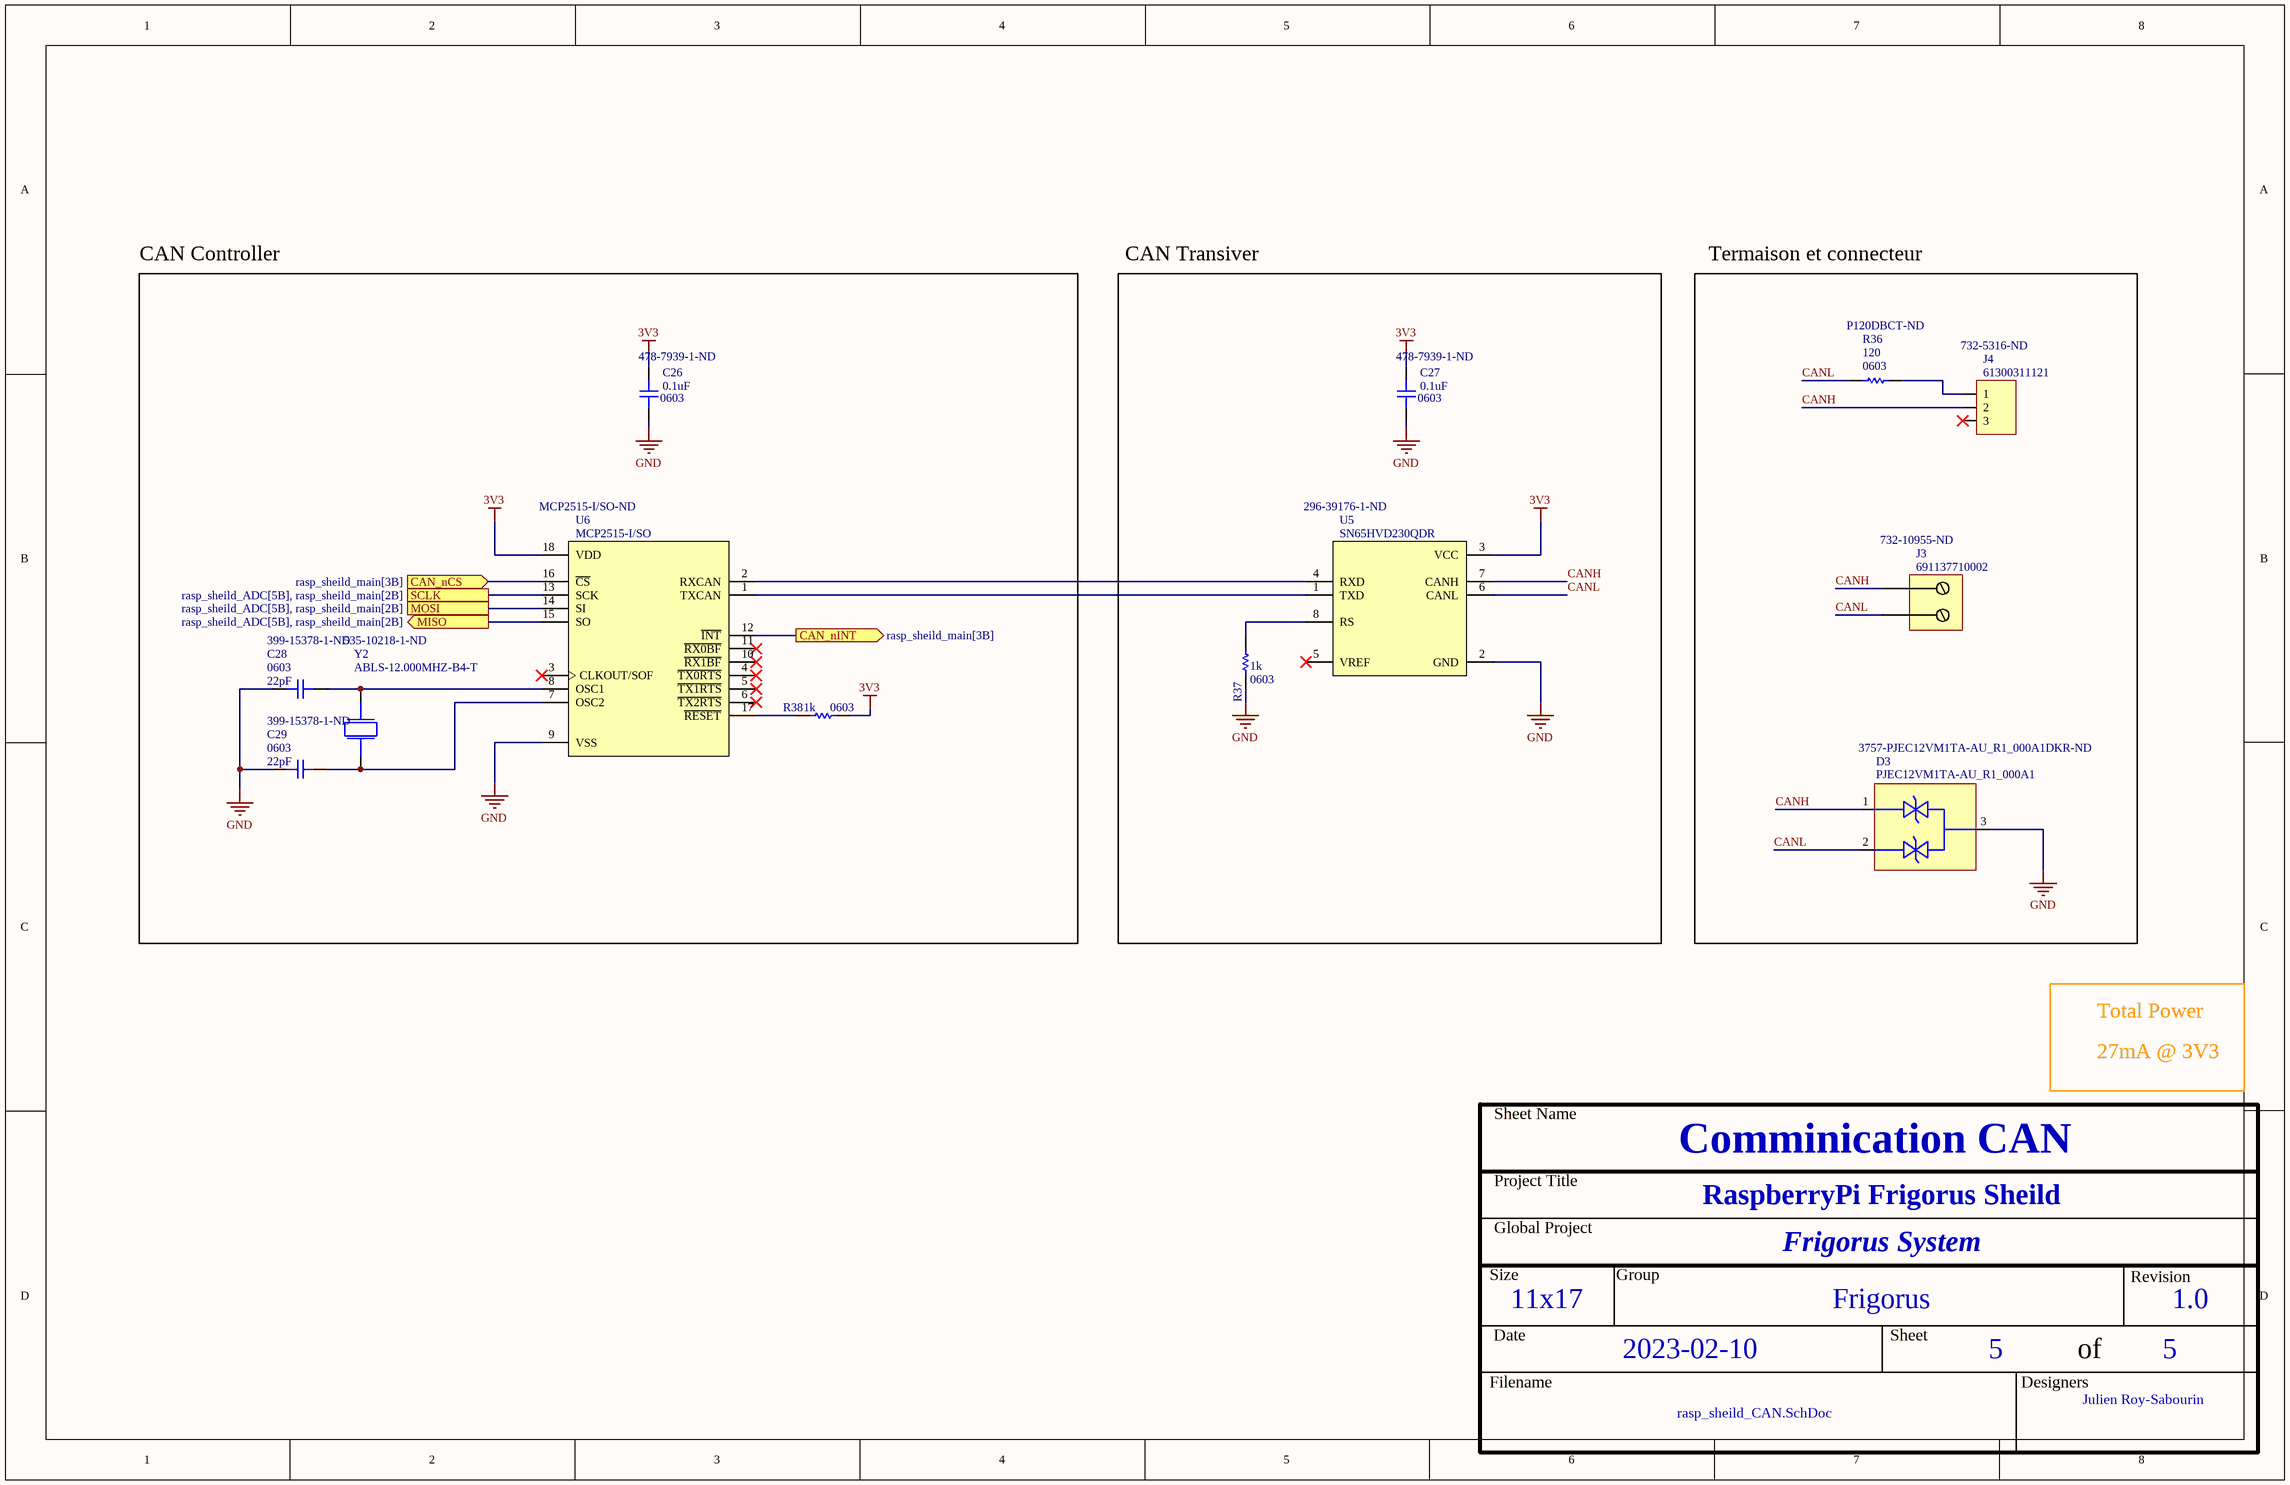
[diagram p4: rasp_sheild_CAN.SchDoc]

### Parts
C26  value 0.1uF  Package: 0603  Supplier Part Number 1: 478-7939-1-ND  [CAP_0603]  (hidden comment: Part Number)
C27  value 0.1uF  Package: 0603  Supplier Part Number 1: 478-7939-1-ND  [CAP_0603]  (hidden comment: Part Number)
C28  value 22pF  Package: 0603  Supplier Part Number 1: 399-15378-1-ND  [CAP_0603]  (hidden comment: Part Number)
C29  value 22pF  Package: 0603  Supplier Part Number 1: 399-15378-1-ND  [CAP_0603]  (hidden comment: Part Number)
D3  PJEC12VM1TA-AU_R1_000A1  Supplier Part Number 1: 3757-PJEC12VM1TA-AU_R1_000A1DKR-ND  [SOT-23-3]
J3  691137710002  Supplier Part Number 1: 732-10955-ND  [691137710002]
J4  61300311121  Supplier Part Number 1: 732-5316-ND  [61300311121]
R36  value 120  Package: 0603  Supplier Part Number 1: P120DBCT-ND  [RES_0603]  (hidden comment: Part Number)
R37  value 1k  Package: 0603  [RES_0603]  (hidden comment: Part Number)
R38  value 1k  Package: 0603  [RES_0603]  (hidden comment: Part Number)
U5  SN65HVD230QDR  Supplier Part Number 1: 296-39176-1-ND  [8-SOIC]
U6  MCP2515-I/SO  Supplier Part Number 1: MCP2515-I/SO-ND  [18-SOIC]
Y2  ABLS-12.000MHZ-B4-T  Supplier Part Number 1: 535-10218-1-ND  [ABLS-12.000MHZ-B4-T]

### Blocks framed on the sheet
CAN Controller: C26 C28 C29 R38 U6 Y2
CAN Transiver: C27 R37 U5
Termaison et connecteur: D3 J3 J4 R36

### Ports
CAN_nCS (in, see rasp_sheild_main[3B]), CAN_nINT (out, see rasp_sheild_main[3B]), MISO (out, see rasp_sheild_ADC[5B], rasp_sheild_main[2B]), MOSI (see rasp_sheild_ADC[5B], rasp_sheild_main[2B]), SCLK (see rasp_sheild_ADC[5B], rasp_sheild_main[2B])

### Nets
3V3: C26.2 C27.2 R38.1 U5.3(VCC) U6.18(VDD)
GND: C26.1 C27.1 C28.2 C29.2 D3.3 R37.2 U5.2(GND) U6.9(VSS)
CAN_nCS: U6.16(~{CS}) ; port CAN_nCS
CAN_nINT: U6.12(~{INT}) ; port CAN_nINT
CANH: D3.1 J3.1 J4.2 U5.7(CANH)
CANL: D3.2 J3.2 R36.2 U5.6(CANL)
MISO: U6.15(SO) ; port MISO
MOSI: U6.14(SI) ; port MOSI
SCLK: U6.13(SCK) ; port SCLK
NetC28_1: C28.1 U6.8(OSC1) Y2.2
NetC29_1: C29.1 U6.7(OSC2) Y2.1
NetJ4_1: J4.1 R36.1
NetR37_1: R37.1 U5.8(RS)
NetR38_2: R38.2 U6.17(~{RESET})
NetU5_1: U5.1(TXD) U6.1(TXCAN)
NetU5_4: U5.4(RXD) U6.2(RXCAN)

Not connected (* = marked no-connect by the designer): J4 3*; U5 5(VREF)*; U6 3(CLKOUT/SOF)* 4(~{TX0RTS})* 5(~{TX1RTS})* 6(~{TX2RTS})* 10(~{RX1BF})* 11(~{RX0BF})*

### Notes on the sheet
- Total Power
- 27mA @ 3V3
- Sheet Name
- Project Title
- Global Project
- Size
- Group
- Revision
- Date
- Sheet
- of
- Filename
- Designers

### Library data of the parts
C26-C29 = CAP_0603: as C2 on sheet rasp_sheild_main; Supplier 1: Digi-Key
D3 = PJEC12VM1TA-AU_R1_000A1: XXX - Description - Package; GRAMS Lib Spec: 2.7; Supplier 1: Digi-Key
J3 = 691137710002: as J6 on sheet rasp_sheild_main; Supplier 1: Digi-Key
J4 = 61300311121: Connector Header Through Hole 3 position 0.100" (2.54mm)pr; GRAMS Lib Spec: 2.7; Supplier 1: Digi-Key
R36-R38 = RES_0603: as R55 on sheet rasp_sheild_main; Supplier 1: Digi-Key
  R37 R38: Supplier Part Number 1: 311-1.00KHRCT-ND
U5 = SN65HVD230QDR: 1/1 Transceiver Half CANbus 8-SOIC; GRAMS Lib Spec: 2.7; Supplier 1: Digi-Key
U6 = MCP2515-I/SO: CANbus Controller CAN 2.0 SPI Interface 18-SOIC; GRAMS Lib Spec: 2.7; Supplier 1: Digi-Key
Y2 = ABLS-12.000MHZ-B4-T: 12 MHz ±30ppm Crystal 18pF 50 Ohms HC-49/US; GRAMS Lib Spec: 2.7; Supplier 1: Digi-Key

## Nets that join several sheets
3V3: rasp_sheild_main (5 pins), rasp_sheild_ADC (18 pins), rasp_sheild_i2c (7 pins), rasp_sheild_CAN (5 pins)
GND: rasp_sheild_title (MH6.1), rasp_sheild_main (23 pins), rasp_sheild_ADC (37 pins), rasp_sheild_i2c (28 pins), rasp_sheild_CAN (8 pins)
ADC1_nCS: rasp_sheild_main (J1.26), rasp_sheild_ADC (U2.20)
ADC1_nEOC: rasp_sheild_main (J1.13), rasp_sheild_ADC (U2.24)
CAN_nCS: rasp_sheild_main (J1.24), rasp_sheild_CAN (U6.16)
CAN_nINT: rasp_sheild_main (J1.22), rasp_sheild_CAN (U6.12)
IO_EXT_INTA: rasp_sheild_main (J1.16), rasp_sheild_i2c (U3.20)
IO_EXT_INTB: rasp_sheild_main (J1.15), rasp_sheild_i2c (U3.19)
MISO: rasp_sheild_main (J1.21), rasp_sheild_ADC (U2.22), rasp_sheild_CAN (U6.15)
MOSI: rasp_sheild_main (J1.19), rasp_sheild_ADC (U2.23), rasp_sheild_CAN (U6.14)
RTC_nINT: rasp_sheild_main (J1.11), rasp_sheild_i2c (R35.2 U4.3)
SCL: rasp_sheild_main (J1.5), rasp_sheild_i2c (C24.2 R33.2 U3.12 U4.6)
SCLK: rasp_sheild_main (J1.23), rasp_sheild_ADC (U2.21), rasp_sheild_CAN (U6.13)
SDA: rasp_sheild_main (J1.3), rasp_sheild_i2c (C25.2 R34.2 U3.13 U4.5)